# Altium schematic sheet [5]-BUTTONS_ILLUMINATION.SchDoc: [5]-BUTTONS_ILLUMINATION
size A3; DocumentNumber: 5; Revision: 01-01-2020; SheetNumber: 5; SheetTotal: 6
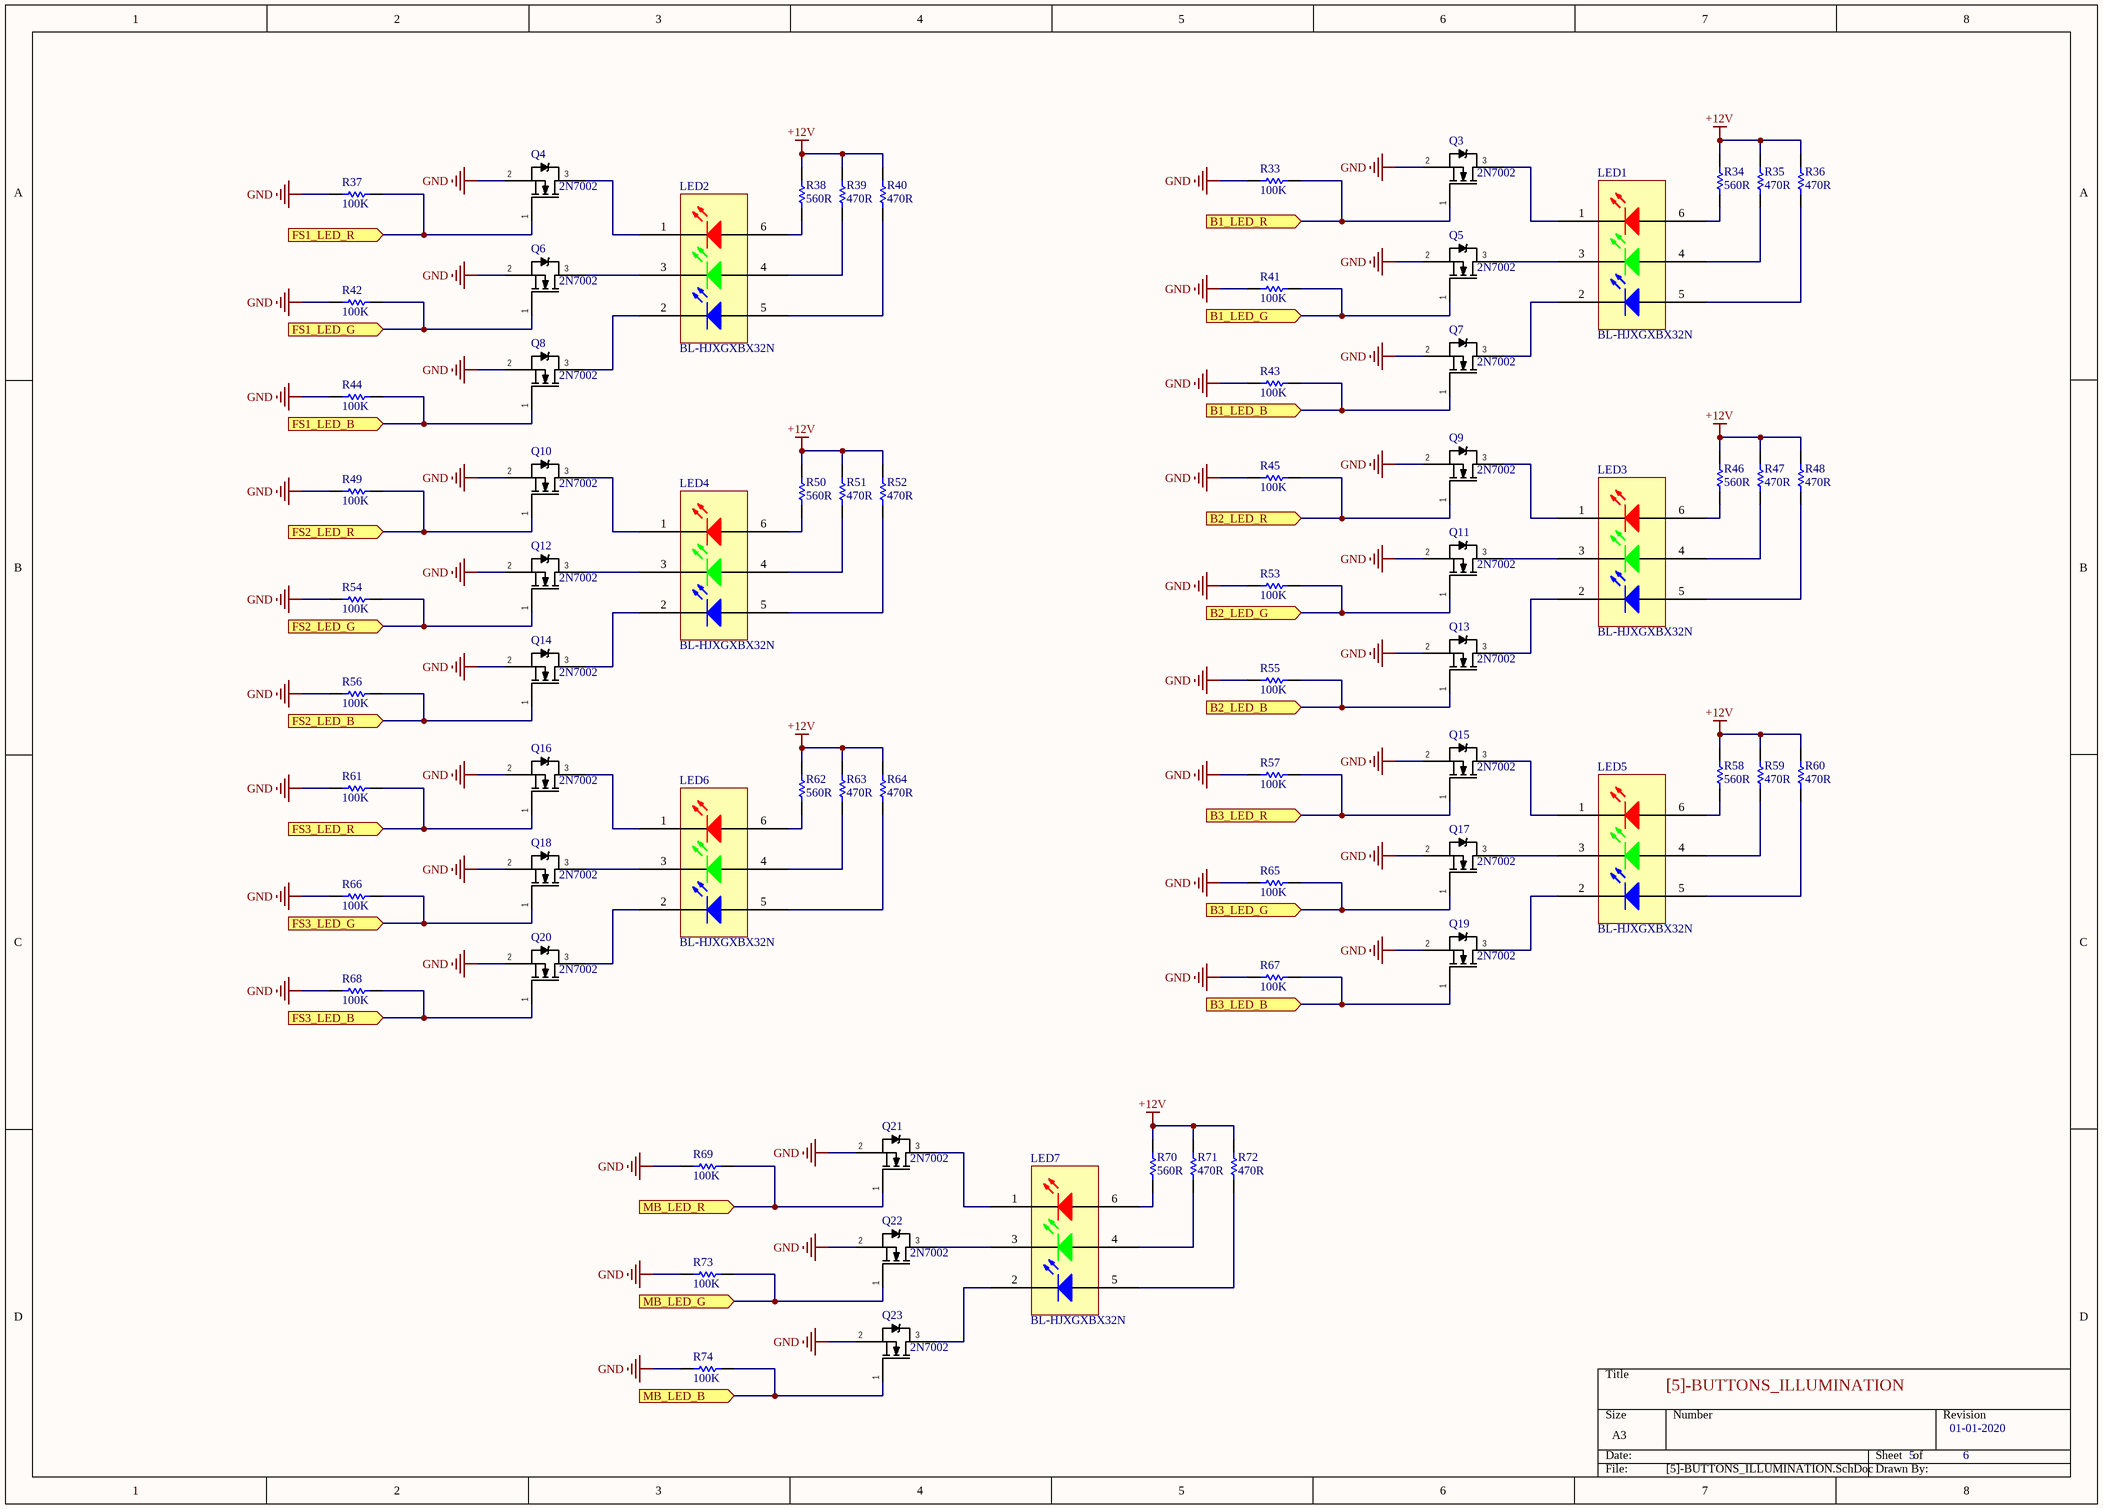
[diagram p0: [5]-BUTTONS_ILLUMINATION.SchDoc]

## Parts
LED1  BL-HJXGXBX32N  [BL-HJXGXBX32N]
LED2  BL-HJXGXBX32N  [BL-HJXGXBX32N]
LED3  BL-HJXGXBX32N  [BL-HJXGXBX32N]
LED4  BL-HJXGXBX32N  [BL-HJXGXBX32N]
LED5  BL-HJXGXBX32N  [BL-HJXGXBX32N]
LED6  BL-HJXGXBX32N  [BL-HJXGXBX32N]
LED7  BL-HJXGXBX32N  [BL-HJXGXBX32N]
Q3  2N7002  [SOT23-3N]
Q4  2N7002  [SOT23-3N]
Q5  2N7002  [SOT23-3N]
Q6  2N7002  [SOT23-3N]
Q7  2N7002  [SOT23-3N]
Q8  2N7002  [SOT23-3N]
Q9  2N7002  [SOT23-3N]
Q10  2N7002  [SOT23-3N]
Q11  2N7002  [SOT23-3N]
Q12  2N7002  [SOT23-3N]
Q13  2N7002  [SOT23-3N]
Q14  2N7002  [SOT23-3N]
Q15  2N7002  [SOT23-3N]
Q16  2N7002  [SOT23-3N]
Q17  2N7002  [SOT23-3N]
Q18  2N7002  [SOT23-3N]
Q19  2N7002  [SOT23-3N]
Q20  2N7002  [SOT23-3N]
Q21  2N7002  [SOT23-3N]
Q22  2N7002  [SOT23-3N]
Q23  2N7002  [SOT23-3N]
R33  100K  [RESC1608N]
R34  560R  [RESC1608N]
R35  470R  [RESC1608N]
R36  470R  [RESC1608N]
R37  100K  [RESC1608N]
R38  560R  [RESC1608N]
R39  470R  [RESC1608N]
R40  470R  [RESC1608N]
R41  100K  [RESC1608N]
R42  100K  [RESC1608N]
R43  100K  [RESC1608N]
R44  100K  [RESC1608N]
R45  100K  [RESC1608N]
R46  560R  [RESC1608N]
R47  470R  [RESC1608N]
R48  470R  [RESC1608N]
R49  100K  [RESC1608N]
R50  560R  [RESC1608N]
R51  470R  [RESC1608N]
R52  470R  [RESC1608N]
R53  100K  [RESC1608N]
R54  100K  [RESC1608N]
R55  100K  [RESC1608N]
R56  100K  [RESC1608N]
R57  100K  [RESC1608N]
R58  560R  [RESC1608N]
R59  470R  [RESC1608N]
R60  470R  [RESC1608N]
R61  100K  [RESC1608N]
R62  560R  [RESC1608N]
R63  470R  [RESC1608N]
R64  470R  [RESC1608N]
R65  100K  [RESC1608N]
R66  100K  [RESC1608N]
R67  100K  [RESC1608N]
R68  100K  [RESC1608N]
R69  100K  [RESC1608N]
R70  560R  [RESC1608N]
R71  470R  [RESC1608N]
R72  470R  [RESC1608N]
R73  100K  [RESC1608N]
R74  100K  [RESC1608N]

## Ports
B1_LED_B (in), B1_LED_G (in), B1_LED_R (in), B2_LED_B (in), B2_LED_G (in), B2_LED_R (in), B3_LED_B (in), B3_LED_G (in), B3_LED_R (in), FS1_LED_B (in), FS1_LED_G (in), FS1_LED_R (in), FS2_LED_B (in), FS2_LED_G (in), FS2_LED_R (in), FS3_LED_B (in), FS3_LED_G (in), FS3_LED_R (in), MB_LED_B (in), MB_LED_G (in), MB_LED_R (in)

## Nets
+12V: R34.2 R35.2 R36.2 R38.2 R39.2 R40.2 R46.2 R47.2 R48.2 R50.2 R51.2 R52.2 R58.2 R59.2 R60.2 R62.2 R63.2 R64.2 R70.2 R71.2 R72.2
GND: Q3.2(S) Q4.2(S) Q5.2(S) Q6.2(S) Q7.2(S) Q8.2(S) Q9.2(S) Q10.2(S) Q11.2(S) Q12.2(S) Q13.2(S) Q14.2(S) Q15.2(S) Q16.2(S) Q17.2(S) Q18.2(S) Q19.2(S) Q20.2(S) Q21.2(S) Q22.2(S) Q23.2(S) R33.2 R37.2 R41.2 R42.2 R43.2 R44.2 R45.2 R49.2 R53.2 R54.2 R55.2 R56.2 R57.2 R61.2 R65.2 R66.2 R67.2 R68.2 R69.2 R73.2 R74.2
B1_LED_B: Q7.1(G) R43.1 ; port B1_LED_B
B1_LED_G: Q5.1(G) R41.1 ; port B1_LED_G
B1_LED_R: Q3.1(G) R33.1 ; port B1_LED_R
B2_LED_B: Q13.1(G) R55.1 ; port B2_LED_B
B2_LED_G: Q11.1(G) R53.1 ; port B2_LED_G
B2_LED_R: Q9.1(G) R45.1 ; port B2_LED_R
B3_LED_B: Q19.1(G) R67.1 ; port B3_LED_B
B3_LED_G: Q17.1(G) R65.1 ; port B3_LED_G
B3_LED_R: Q15.1(G) R57.1 ; port B3_LED_R
FS1_LED_B: Q8.1(G) R44.1 ; port FS1_LED_B
FS1_LED_G: Q6.1(G) R42.1 ; port FS1_LED_G
FS1_LED_R: Q4.1(G) R37.1 ; port FS1_LED_R
FS2_LED_B: Q14.1(G) R56.1 ; port FS2_LED_B
FS2_LED_G: Q12.1(G) R54.1 ; port FS2_LED_G
FS2_LED_R: Q10.1(G) R49.1 ; port FS2_LED_R
FS3_LED_B: Q20.1(G) R68.1 ; port FS3_LED_B
FS3_LED_G: Q18.1(G) R66.1 ; port FS3_LED_G
FS3_LED_R: Q16.1(G) R61.1 ; port FS3_LED_R
MB_LED_B: Q23.1(G) R74.1 ; port MB_LED_B
MB_LED_G: Q22.1(G) R73.1 ; port MB_LED_G
MB_LED_R: Q21.1(G) R69.1 ; port MB_LED_R
NetLED1_1: LED1.1 Q3.3(D)
NetLED1_2: LED1.2 Q7.3(D)
NetLED1_3: LED1.3 Q5.3(D)
NetLED1_4: LED1.4 R35.1
NetLED1_5: LED1.5 R36.1
NetLED1_6: LED1.6 R34.1
NetLED2_1: LED2.1 Q4.3(D)
NetLED2_2: LED2.2 Q8.3(D)
NetLED2_3: LED2.3 Q6.3(D)
NetLED2_4: LED2.4 R39.1
NetLED2_5: LED2.5 R40.1
NetLED2_6: LED2.6 R38.1
NetLED3_1: LED3.1 Q9.3(D)
NetLED3_2: LED3.2 Q13.3(D)
NetLED3_3: LED3.3 Q11.3(D)
NetLED3_4: LED3.4 R47.1
NetLED3_5: LED3.5 R48.1
NetLED3_6: LED3.6 R46.1
NetLED4_1: LED4.1 Q10.3(D)
NetLED4_2: LED4.2 Q14.3(D)
NetLED4_3: LED4.3 Q12.3(D)
NetLED4_4: LED4.4 R51.1
NetLED4_5: LED4.5 R52.1
NetLED4_6: LED4.6 R50.1
NetLED5_1: LED5.1 Q15.3(D)
NetLED5_2: LED5.2 Q19.3(D)
NetLED5_3: LED5.3 Q17.3(D)
NetLED5_4: LED5.4 R59.1
NetLED5_5: LED5.5 R60.1
NetLED5_6: LED5.6 R58.1
NetLED6_1: LED6.1 Q16.3(D)
NetLED6_2: LED6.2 Q20.3(D)
NetLED6_3: LED6.3 Q18.3(D)
NetLED6_4: LED6.4 R63.1
NetLED6_5: LED6.5 R64.1
NetLED6_6: LED6.6 R62.1
NetLED7_1: LED7.1 Q21.3(D)
NetLED7_2: LED7.2 Q23.3(D)
NetLED7_3: LED7.3 Q22.3(D)
NetLED7_4: LED7.4 R71.1
NetLED7_5: LED7.5 R72.1
NetLED7_6: LED7.6 R70.1

## Library data of the parts
LED1-LED7 = BL-HJXGXBX32N: LED RGB 6PLCC SMD; Manufacturer 1: American Bright; Supplier 1: Digi-Key; Manufacturer Part Number 1: BL-HJXGXBX32N; Stock 1: 23855; Pricing 1: 1=0.59000, 10=0.42700, 100=0.27880, 500=0.20040, 1000=0.15683 (USD); RoHS: No; Packaging: Cut Tape; Supplier Part Number 1: BL-HJXGXBX32NCT-ND
Q3-Q23 = 2N7002: MOSFET N-CH 60V 115MA SOT-23; Manufacturer 1: ON Semiconductor / Fairchild; Max Power Dissipation: 200mW; Drain to Source Resistance: 1.2R; Gate to Source Voltage (Vgs): 20V; Nominal Vgs: 2.1V; Number of Elements: 1; Element Configuration: Single; Input Capacitance: 50pF; Rds On Max: 7.5R; On-State Resistance: 5.3R; Supplier 1: Digi-Key; Manufacturer Part Number 1: 2N7002; Stock 1: 111118; Pricing 1: 1=0.33, 10=0.304, 100=0.17, 500=0.09108, 1000=0.06193 (USD); Mount: Surface Mount; Case/Package: SOT-23; Number of Pins: 3; Contact Plating: Tin,Matte; Min Operating Temperature: -55°C; Max Operating Temperature: 150°C; Continuous Drain Current (ID): 115mA; Packaging: Tape and Reel; Package Quantity: 1; Drain to Source Voltage (Vdss): 60V; Drain to Source Breakdown Voltage: 60V; Power Dissipation: 200mW; Threshold Voltage: 2.1V; Voltage Rating (DC): 60V; Current Rating: 115mA; Dual Supply Voltage: 60V; Current: 115mA; Voltage: 60V; Length: 2.92mm; Height: 0.93mm; Width: 3.05mm; Radiation Hardening: No; REACH SVHC: No SVHC; Lead Free: Lead Free; ComponentLink1URL: https://datasheet.ciiva.com/931/2n7000-931777.pdf; ComponentLink1Description: https://datasheet.ciiva.com/931/2n7000-931777.pdf; ComponentLink2URL: https://datasheet.ciiva.com/27746/47-0120-27746881.pdf; ComponentLink2Description: https://datasheet.ciiva.com/27746/47-0120-27746881.pdf; ComponentLink3URL: https://datasheet.ciiva.com/1254/2n7002-1254451.pdf; ComponentLink3Description: https://datasheet.ciiva.com/1254/2n7002-1254451.pdf; ComponentLink4URL: https://datasheet.ciiva.com/15137/getdatasheetpartid-93547-15137771.pdf; ComponentLink4Description: https://datasheet.ciiva.com/15137/getdatasheetpartid-93547-15137771.pdf; ComponentLink5URL: https://datasheet.ciiva.com/931/2n7000-931762.pdf; ComponentLink5Description: https://datasheet.ciiva.com/931/2n7000-931762.pdf; ComponentLink6URL: https://datasheet.ciiva.com/931/2n7000-931763.pdf; ComponentLink6Description: https://datasheet.ciiva.com/931/2n7000-931763.pdf; ComponentLink7URL: https://datasheet.ciiva.com/931/2n7000-931764.pdf; ComponentLink7Description: https://datasheet.ciiva.com/931/2n7000-931764.pdf; ComponentLink8URL: https://datasheet.ciiva.com/1254/660093-1254452.pdf; ComponentLink8Description: https://datasheet.ciiva.com/1254/660093-1254452.pdf; ComponentLink9URL: https://datasheet.ciiva.com/1188/660093-1188359.pdf; ComponentLink9Description: https://datasheet.ciiva.com/1188/660093-1188359.pdf; ComponentLink10URL: https://datasheet.ciiva.com/1188/660093-1188361.pdf; ComponentLink10Description: https://datasheet.ciiva.com/1188/660093-1188361.pdf; ComponentLink11URL: https://datasheet.ciiva.com/17007/2n7002-17007243.pdf; ComponentLink11Description: https://datasheet.ciiva.com/17007/2n7002-17007243.pdf; ComponentLink12URL: https://datasheet.ciiva.com/3304/nds7002a-3304380.pdf; ComponentLink12Description: https://datasheet.ciiva.com/3304/nds7002a-3304380.pdf; ComponentLink13URL: https://datasheet.ciiva.com/3304/nds7002a-3304381.pdf; ComponentLink13Description: https://datasheet.ciiva.com/3304/nds7002a-3304381.pdf; ComponentLink14URL: https://datasheet.ciiva.com/22655/660093-22655230.pdf; ComponentLink14Description: https://datasheet.ciiva.com/22655/660093-22655230.pdf; Supplier Part Number 1: 2N7002NCT-ND
R33 R37 R41-R45 R49 R53-R57 R61 R65-R69 R73 R74 = ESR03EZPJ104: RES SMD 100K OHM 5% 1/4W 0603; Manufacturer 1: Rohm; Resistance: 100kR; Power Rating: 200mW; Max Power Dissipation: 250mW; Temperature Coefficient: 200ppm/°C; Supplier 1: Digi-Key; Manufacturer Part Number 1: ESR03EZPJ104; Stock 1: 17901; Pricing 1: 1=0.1, 10=0.087, 100=0.0333, 1000=0.01464, 2500=0.01264 (USD); Case/Package: 0603; Case Code (Metric): 1608; Case Code (Imperial): 0603; Min Operating Temperature: -55°C; Max Operating Temperature: 155°C; Tolerance: 5%; Package Quantity: 1; Packaging: Cut Tape; Composition: Thick Film; Number of Terminations: 2; Length: 0.063inch; Height: 0.022inch; Width: 0.031inch; Lead Free: Lead Free; ComponentLink1URL: https://datasheet.ciiva.com/14930/esr-14930633.pdf; ComponentLink1Description: https://datasheet.ciiva.com/14930/esr-14930633.pdf; ComponentLink2URL: https://datasheet.ciiva.com/14924/esr-14924811.pdf; ComponentLink2Description: https://datasheet.ciiva.com/14924/esr-14924811.pdf; ComponentLink3URL: https://datasheet.ciiva.com/14928/esr-14928813.pdf; ComponentLink3Description: https://datasheet.ciiva.com/14928/esr-14928813.pdf; Supplier Part Number 1: RHM100KDCT-ND
R34 R38 R46 R50 R58 R62 R70 = AC0603JR-07560RL: RES SMD 560 OHM 5% 1/10W 0603; Manufacturer 1: Yageo; Power Rating: 100mW; Voltage Rating: 50V; Temperature Coefficient: 100ppm/°C; Supplier 1: Digi-Key; Manufacturer Part Number 1: AC0603JR-07560RL; Stock 1: 24630; Pricing 1: 1=0.1, 10=0.026, 100=0.0107, 1000=0.00478, 2500=0.00415 (USD); Case/Package: 0603; Case Code (Imperial): 0603; Case Code (Metric): 1608; Min Operating Temperature: -55°C; Max Operating Temperature: 155°C; Packaging: Tape and Reel; Resistance: 560R; Tolerance: 5%; Composition: Thick Film; Number of Terminations: 2; Termination: SMD/SMT; Max Power Dissipation: 100mW; Length: 0.063inch; Height: 0.022inch; Width: 0.031inch; ComponentLink1URL: http://www.yageo.com/NewPortal/yageodocoutput?fileName=/pdf/R-Chip/PYu-AC_51_RoHS_L_6.pdf; ComponentLink1Description: http://www.yageo.com/NewPortal/yageodocoutput?fileName=/pdf/R-Chip/PYu-AC_51_RoHS_L_6.pdf; ComponentLink2URL: http://www.mouser.com/ds/2/447/yageodocoutput-1111992.pdf; ComponentLink2Description: http://www.mouser.com/ds/2/447/yageodocoutput-1111992.pdf; Supplier Part Number 1: YAG3681CT-ND
R35 R36 R39 R40 R47 R48 R51 R52 R59 R60 R63 R64 R71 R72 = RMCF0603JT470R: RES SMD 470 OHM 5% 1/10W 0603; Manufacturer 1: Stackpole Electronics; Power Rating: 100mW; Temperature Coefficient: 100ppm/°C; Working Voltage: 75V; Supplier 1: Digi-Key; Manufacturer Part Number 1: RMCF0603JT470R; Stock 1: 1799; Pricing 1: 1=0.1, 10=0.013, 100=0.0051, 1000=0.0023, 2500=0.002 (USD); Mount: Surface Mount; Case/Package: 0603; Case Code (Metric): 1608; Case Code (Imperial): 0603; Contact Plating: Tin,Matte; Min Operating Temperature: -55°C; Max Operating Temperature: 155°C; Packaging: Tape and Reel; Resistance: 470R; Tolerance: 5%; Package Quantity: 1; Composition: Thick Film; Number of Terminations: 2; Military Standard: Not; Max Power Dissipation: 100mW; Features: Automotive AEC-Q200; Length: 1.55mm; Height: 0.022inch; Width: 0.031inch; Depth: 0.8mm; Radiation Hardening: No; Lead Free: Lead Free; ComponentLink1URL: https://datasheet.ciiva.com/15193/getdatasheetpartid-360691-15193516.pdf; ComponentLink1Description: https://datasheet.ciiva.com/15193/getdatasheetpartid-360691-15193516.pdf; Supplier Part Number 1: RMCF0603JT470RCT-ND